# Altium schematic sheet LSD4RF_2F717N30_Interface.SchDoc
size A4
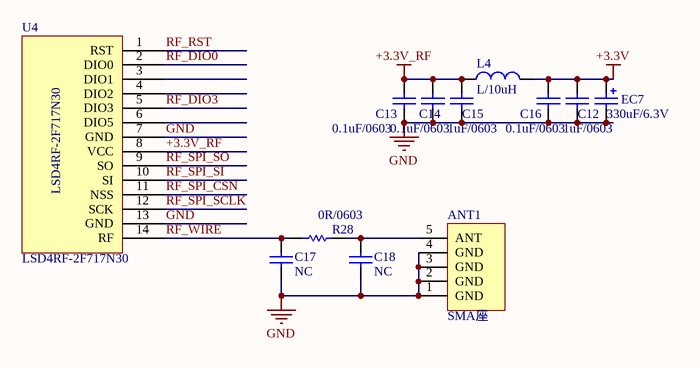
[diagram p0: LSD4RF_2F717N30_Interface.SchDoc]

## Parts
ANT1  SMA座  [SMA]
C12  1uF/0603  [CAP/SMT/0603C]
C13  0.1uF/0603  [CAP/SMT/0603C]
C14  0.1uF/0603  [CAP/SMT/0603C]
C15  1uF/0603  [CAP/SMT/0603C]
C16  0.1uF/0603  [CAP/SMT/0603C]
C17  NC  [CAP/SMT/0603C]
C18  NC  [CAP/SMT/0603C]
EC7  330uF/6.3V  [CAP/SMT/330UF/6.3V]
L4  L/10uH  [L/SMT/0603L]
R28  0R/0603  [0603R]
U4  LSD4RF-2F717N30  [MODEL/LSD4RF-2F717N30]

## Nets
+3.3V: C12.2 C16.1 EC7.1 L4.2
+3.3V_RF: C13.1 C14.1 C15.1 L4.1 U4.8(VCC)
GND: ANT1.1(GND) ANT1.2(GND) ANT1.3(GND) ANT1.4(GND) C12.1 C13.2 C14.2 C15.2 C16.2 C17.1 C18.1 EC7.2 U4.7(GND) U4.13(GND)
RF_DIO0: U4.2(DIO0)
RF_DIO3: U4.5(DIO3)
RF_RST: U4.1(RST)
RF_SPI_CSN: U4.11(NSS)
RF_SPI_SCLK: U4.12(SCK)
RF_SPI_SI: U4.10(SI)
RF_SPI_SO: U4.9(SO)
RF_WIRE: C17.2 R28.1 U4.14(RF)
NetANT1_5: ANT1.5(ANT) C18.2 R28.2

Not connected (* = marked no-connect by the designer): U4 3(DIO1) 4(DIO2) 6(DIO5)

## Library data of the parts
ANT1 = OTHER/Antena/SMA座
C12-C18 = CAP/CAP/SMT/0603C
EC7 = CAP/AEC/SMT/330uF/6.3V
L4 = L/BEAD/SMT/0603L
R28 = RES/RES/SMT/0603
U4 = MODLE/RF/LSD4RF-2F717N30